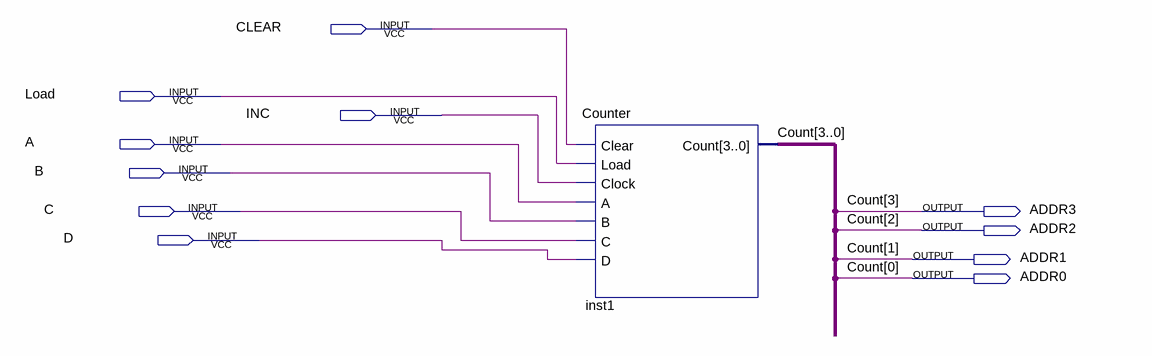
[diagram p0: schematic sheet]
// Quartus schematic TRISCPC.bdf as structural Verilog: 1 symbols, 11 pins
module TRISCPC (
  input  CLEAR,
  input  Load,
  input  INC,
  input  A,
  input  B,
  input  C,
  input  D,
  output ADDR3,
  output ADDR2,
  output ADDR1,
  output ADDR0
);

  Counter inst1 (
    .Clear(CLEAR), .Load(Load), .Clock(INC), .A(A), .B(B), .C(C), .D(D), .Count({ADDR3, ADDR2, ADDR1, ADDR0}));

  // Other names for the same wires on the sheet: Count[3:0] = {ADDR3, ADDR2, ADDR1, ADDR0}
endmodule
